# EAGLE design cft-mem-board (EAGLE 7.6.0)

## Sheet 1 of 2
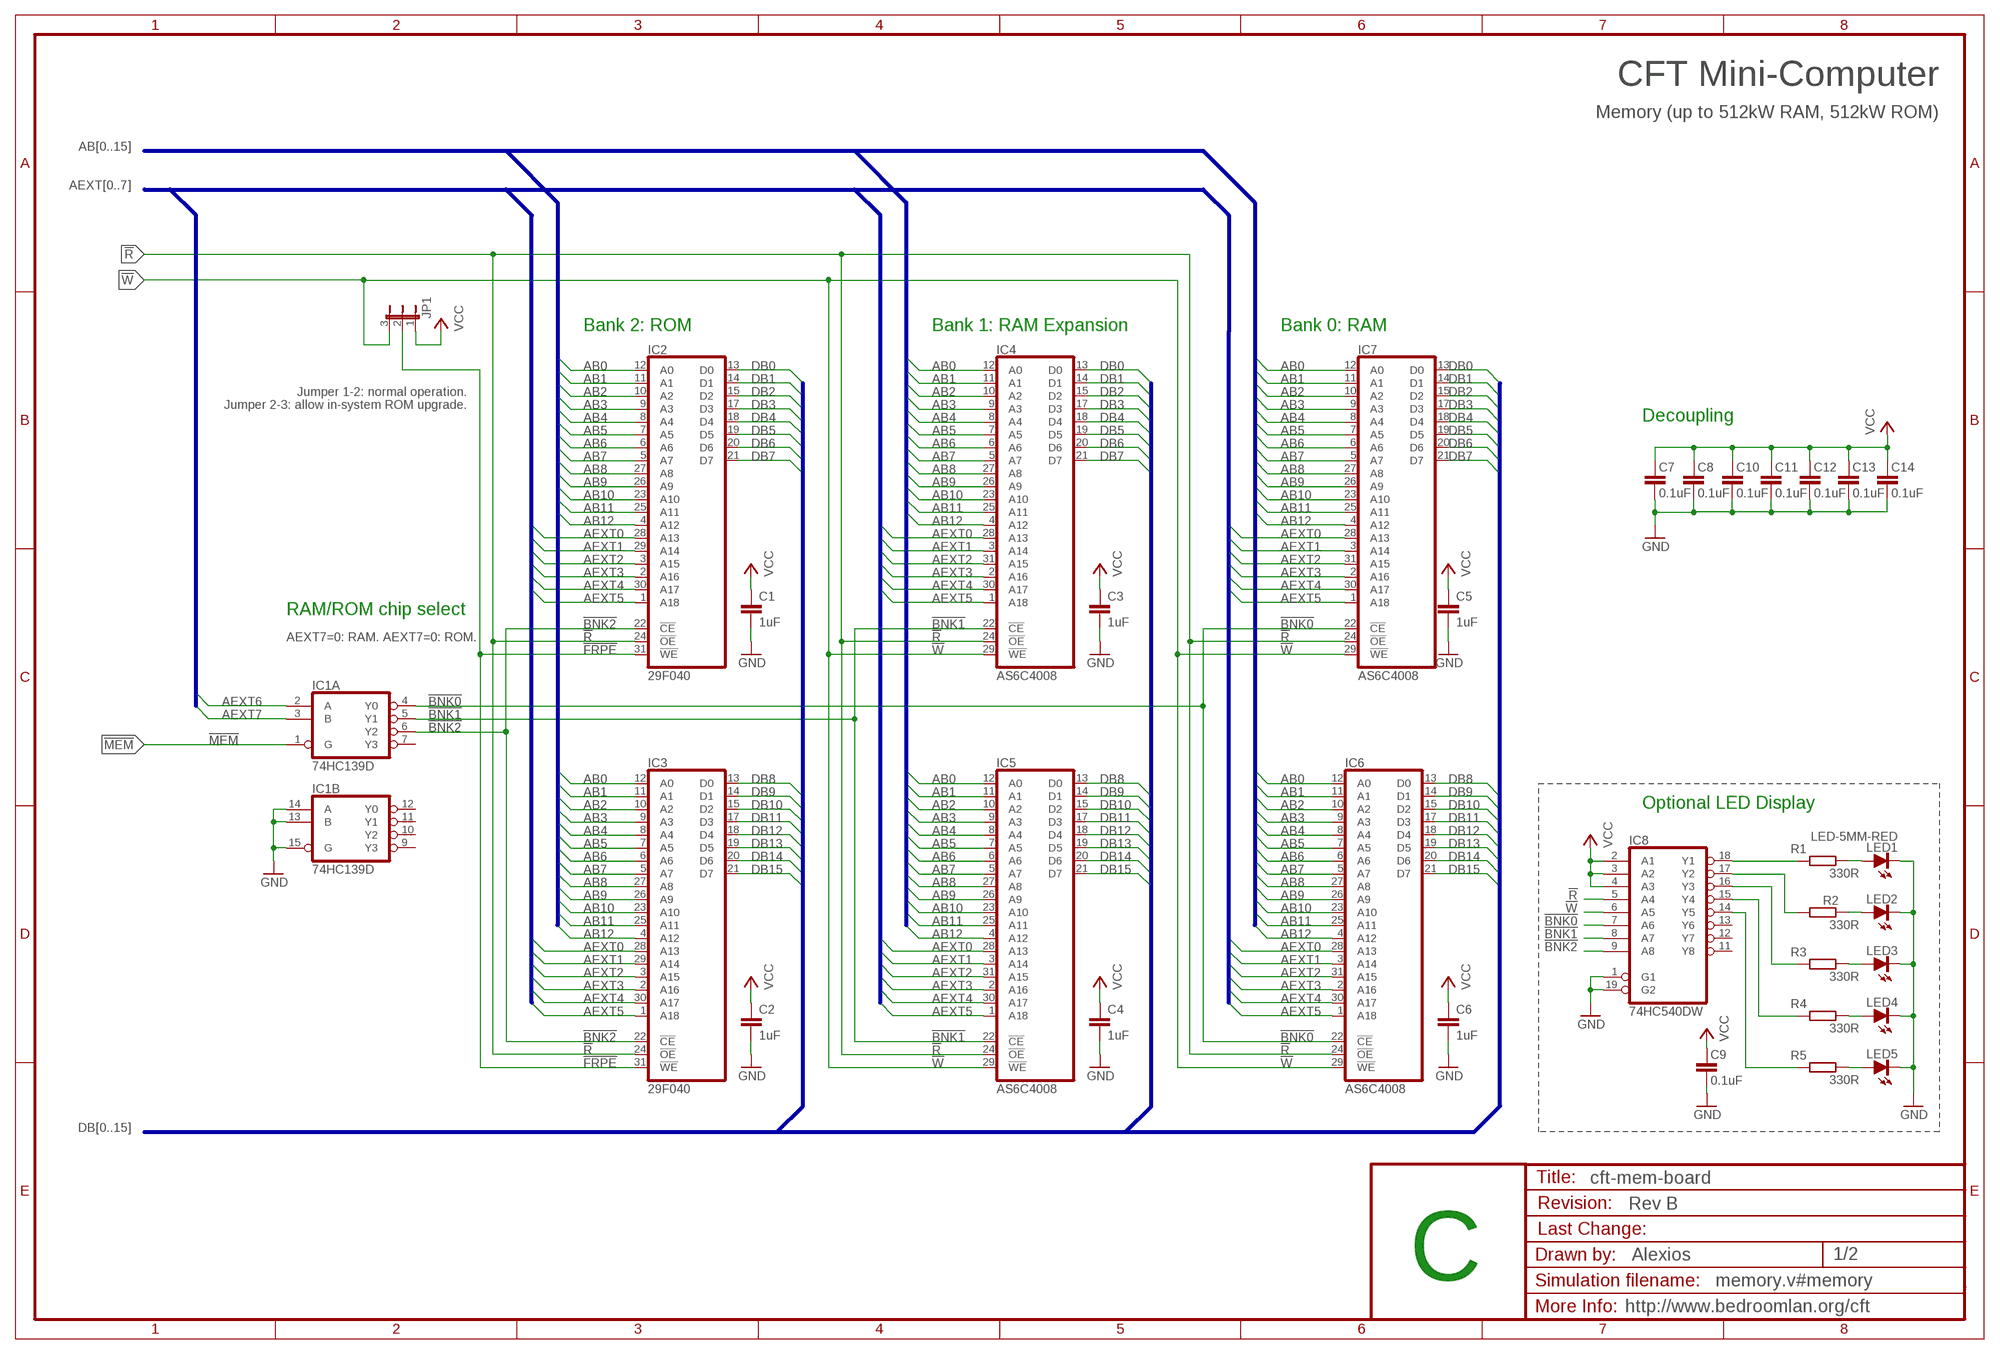
[diagram p0: schematic, sheet 1]
FRAME1 (FRAME-A3): DRAWN_BY: Alexios; PROJECT_NAME: CFT Mini-Computer; REVISION: Rev B; SHEET_DESCRIPTION: Memory (up to 512kW RAM, 512kW ROM); SIMULATION_FILENAME: memory.v#memory; URL: http://www.bedroomlan.org/cft

### Parts
C1  1uF  C-EUC0805K  [C0805K]
C2  1uF  C-EUC0805K  [C0805K]
C3  1uF  C-EUC0805K  [C0805K]
C4  1uF  C-EUC0805K  [C0805K]
C5  1uF  C-EUC0805K  [C0805K]
C6  1uF  C-EUC0805K  [C0805K]
C7  0.1uF  C-EUC0805K  [C0805K]
C8  0.1uF  C-EUC0805K  [C0805K]
C9  0.1uF  C-EUC0805K  [C0805K]
C10  0.1uF  C-EUC0805K  [C0805K]
C11  0.1uF  C-EUC0805K  [C0805K]
C12  0.1uF  C-EUC0805K  [C0805K]
C13  0.1uF  C-EUC0805K  [C0805K]
C14  0.1uF  C-EUC0805K  [C0805K]
IC1  74HC139D  [SO16]
IC2  29F040  29F040PLCC32  [PLCC32]
IC3  29F040  29F040PLCC32  [PLCC32]
IC4  AS6C4008  AS6C400855PCN  [DIL32]
IC5  AS6C4008  AS6C400855PCN  [DIL32]
IC6  AS6C4008  AS6C400855PCN  [DIL32]
IC7  AS6C4008  AS6C400855PCN  [DIL32]
IC8  74HC540DW  [SO20W]
JP1  JP2E  [JP2]
LED1  LED-5MM-RED  LEDCHIPLED_0805  [CHIPLED_0805]
LED2  LEDCHIPLED_0805  [CHIPLED_0805]
LED3  LEDCHIPLED_0805  [CHIPLED_0805]
LED4  LEDCHIPLED_0805  [CHIPLED_0805]
LED5  LEDCHIPLED_0805  [CHIPLED_0805]
R1  330R  R-EU_R0805  [R0805]
R2  330R  R-EU_R0805  [R0805]
R3  330R  R-EU_R0805  [R0805]
R4  330R  R-EU_R0805  [R0805]
R5  330R  R-EU_R0805  [R0805]

### Nets
!BNK0: IC1.4(A:Y0) IC6.22(!CE) IC7.22(!CE) IC8.7(A6)
!BNK1: IC1.5(A:Y1) IC4.22(!CE) IC5.22(!CE) IC8.8(A7)
!BNK2: IC1.6(A:Y2) IC2.22(!CE) IC3.22(!CE) IC8.9(A8)
!FRPE: IC2.31(!WE) IC3.31(!WE) JP1.2
!MEM: IC1.1(A:G) ; also sheet 2
!R: IC2.24(!OE) IC3.24(!OE) IC4.24(!OE) IC5.24(!OE) IC6.24(!OE) IC7.24(!OE) IC8.5(A4) ; also sheet 2
!W: IC4.29(!WE) IC5.29(!WE) IC6.29(!WE) IC7.29(!WE) IC8.6(A5) JP1.3 ; also sheet 2
AB0: IC2.12(A0) IC3.12(A0) IC4.12(A0) IC5.12(A0) IC6.12(A0) IC7.12(A0) ; also sheet 2
AB1: IC2.11(A1) IC3.11(A1) IC4.11(A1) IC5.11(A1) IC6.11(A1) IC7.11(A1) ; also sheet 2
AB2: IC2.10(A2) IC3.10(A2) IC4.10(A2) IC5.10(A2) IC6.10(A2) IC7.10(A2) ; also sheet 2
AB3: IC2.9(A3) IC3.9(A3) IC4.9(A3) IC5.9(A3) IC6.9(A3) IC7.9(A3) ; also sheet 2
AB4: IC2.8(A4) IC3.8(A4) IC4.8(A4) IC5.8(A4) IC6.8(A4) IC7.8(A4) ; also sheet 2
AB5: IC2.7(A5) IC3.7(A5) IC4.7(A5) IC5.7(A5) IC6.7(A5) IC7.7(A5) ; also sheet 2
AB6: IC2.6(A6) IC3.6(A6) IC4.6(A6) IC5.6(A6) IC6.6(A6) IC7.6(A6) ; also sheet 2
AB7: IC2.5(A7) IC3.5(A7) IC4.5(A7) IC5.5(A7) IC6.5(A7) IC7.5(A7) ; also sheet 2
AB8: IC2.27(A8) IC3.27(A8) IC4.27(A8) IC5.27(A8) IC6.27(A8) IC7.27(A8) ; also sheet 2
AB9: IC2.26(A9) IC3.26(A9) IC4.26(A9) IC5.26(A9) IC6.26(A9) IC7.26(A9) ; also sheet 2
AB10: IC2.23(A10) IC3.23(A10) IC4.23(A10) IC5.23(A10) IC6.23(A10) IC7.23(A10) ; also sheet 2
AB11: IC2.25(A11) IC3.25(A11) IC4.25(A11) IC5.25(A11) IC6.25(A11) IC7.25(A11) ; also sheet 2
AB12: IC2.4(A12) IC3.4(A12) IC4.4(A12) IC5.4(A12) IC6.4(A12) IC7.4(A12) ; also sheet 2
AEXT0: IC2.28(A13) IC3.28(A13) IC4.28(A13) IC5.28(A13) IC6.28(A13) IC7.28(A13) ; also sheet 2
AEXT1: IC2.29(A14) IC3.29(A14) IC4.3(A14) IC5.3(A14) IC6.3(A14) IC7.3(A14) ; also sheet 2
AEXT2: IC2.3(A15) IC3.3(A15) IC4.31(A15) IC5.31(A15) IC6.31(A15) IC7.31(A15) ; also sheet 2
AEXT3: IC2.2(A16) IC3.2(A16) IC4.2(A16) IC5.2(A16) IC6.2(A16) IC7.2(A16) ; also sheet 2
AEXT4: IC2.30(A17) IC3.30(A17) IC4.30(A17) IC5.30(A17) IC6.30(A17) IC7.30(A17) ; also sheet 2
AEXT5: IC2.1(A18) IC3.1(A18) IC4.1(A18) IC5.1(A18) IC6.1(A18) IC7.1(A18) ; also sheet 2
AEXT6: IC1.2(A:A) ; also sheet 2
AEXT7: IC1.3(A:B) ; also sheet 2
DB0: IC2.13(D0) IC4.13(D0) IC7.13(D0) ; also sheet 2
DB1: IC2.14(D1) IC4.14(D1) IC7.14(D1) ; also sheet 2
DB2: IC2.15(D2) IC4.15(D2) IC7.15(D2) ; also sheet 2
DB3: IC2.17(D3) IC4.17(D3) IC7.17(D3) ; also sheet 2
DB4: IC2.18(D4) IC4.18(D4) IC7.18(D4) ; also sheet 2
DB5: IC2.19(D5) IC4.19(D5) IC7.19(D5) ; also sheet 2
DB6: IC2.20(D6) IC4.20(D6) IC7.20(D6) ; also sheet 2
DB7: IC2.21(D7) IC4.21(D7) IC7.21(D7) ; also sheet 2
DB8: IC3.13(D0) IC5.13(D0) IC6.13(D0) ; also sheet 2
DB9: IC3.14(D1) IC5.14(D1) IC6.14(D1) ; also sheet 2
DB10: IC3.15(D2) IC5.15(D2) IC6.15(D2) ; also sheet 2
DB11: IC3.17(D3) IC5.17(D3) IC6.17(D3) ; also sheet 2
DB12: IC3.18(D4) IC5.18(D4) IC6.18(D4) ; also sheet 2
DB13: IC3.19(D5) IC5.19(D5) IC6.19(D5) ; also sheet 2
DB14: IC3.20(D6) IC5.20(D6) IC6.20(D6) ; also sheet 2
DB15: IC3.21(D7) IC5.21(D7) IC6.21(D7) ; also sheet 2
GND [low power]: C1.2 C2.2 C3.2 C4.2 C5.2 C6.2 C7.1 C8.1 C9.1 C10.1 C11.1 C12.1 C13.1 C14.1 IC1.13(B:B) IC1.14(B:A) IC1.15(B:G) IC8.1(G1) IC8.19(G2) LED1.C LED2.C LED3.C LED4.C LED5.C ; also sheet 2
N$1: LED1.A R1.2
N$2: LED2.A R2.2
N$3: LED3.A R3.2
N$4: LED4.A R4.2
N$5: LED5.A R5.2
N$6: IC8.14(Y5) R5.1
N$7: IC8.17(Y2) R2.1
N$8: IC8.16(Y3) R3.1
N$9: IC8.15(Y4) R4.1
N$10: IC8.18(Y1) R1.1
VCC [low power]: C1.1 C2.1 C3.1 C4.1 C5.1 C6.1 C7.2 C8.2 C9.2 C10.2 C11.2 C12.2 C13.2 C14.2 IC8.2(A1) IC8.3(A2) IC8.4(A3) JP1.1 ; also sheet 2
Unconnected: IC1.7(A:Y3) IC1.9(B:Y3) IC1.10(B:Y2) IC1.11(B:Y1) IC1.12(B:Y0) IC8.11(Y8) IC8.12(Y7) IC8.13(Y6)

### Buses
AB[0..15]
DB[0..15]
AEXT[0..7]

### Notes on the sheet
- Bank 2: ROM | Bank 1: RAM Expansion | Bank 0: RAM
- Jumper 1-2: normal operation.
- Jumper 2-3: allow in-system ROM upgrade.
- Decoupling
- RAM/ROM chip select
- AEXT7=0: RAM. AEXT7=0: ROM.
- Optional LED Display
- C

## Sheet 2 of 2
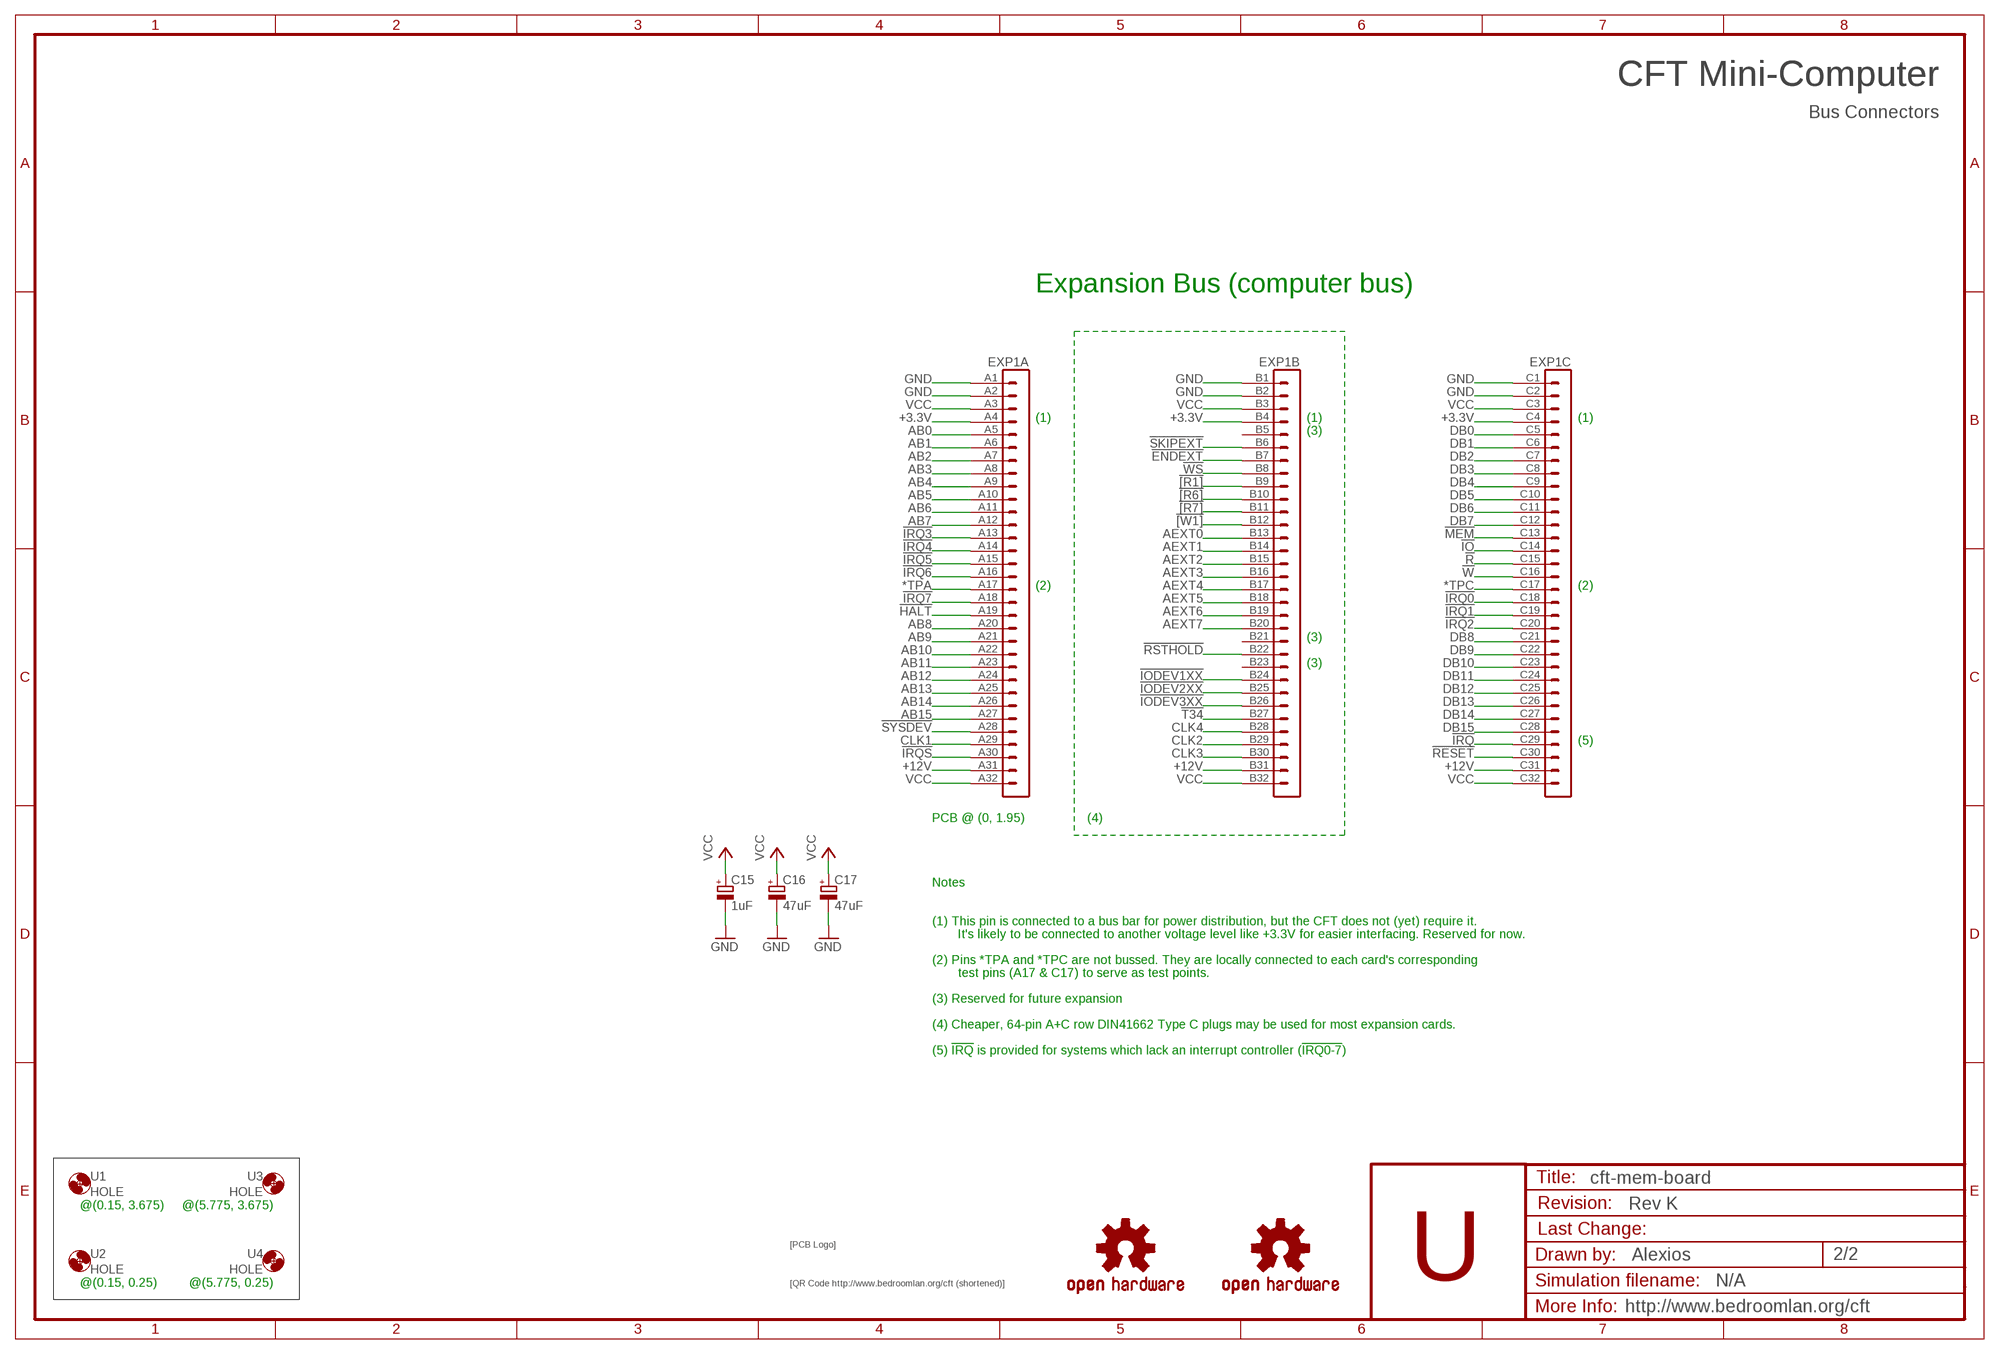
[diagram p1: schematic, sheet 2]
FRAME2 (FRAME-A3): DRAWN_BY: Alexios; PROJECT_NAME: CFT Mini-Computer; REVISION: Rev K; SHEET_DESCRIPTION: Bus Connectors; SIMULATION_FILENAME: N/A; URL: http://www.bedroomlan.org/cft

### Parts
$4_37_$1  SIGNATURESILK  [SIGNATURE]
$4_39_$  OSHW-LOGOL  [OSHW-LOGO-L]
$4_39_$1  OSHW-LOGOL  [OSHW-LOGO-L]
$4_40_$  QRCODE-CFT  [CFT-QRCODE]
C15  1uF  CPOL-EUE2.5-5  [E2,5-5]
C16  47uF  CPOL-EUE2.5-5  [E2,5-5]
C17  47uF  CPOL-EUE2.5-5  [E2,5-5]
EXP1  VG96-3K  [VG96K]
U1  HOLE  [STANDOFF_28_60]
U2  HOLE  [STANDOFF_28_60]
U3  HOLE  [STANDOFF_28_60]
U4  HOLE  [STANDOFF_28_60]

### Nets
![R1]: EXP1.B9
![R6]: EXP1.B10
![R7]: EXP1.B11
![W1]: EXP1.B12
!ENDEXT: EXP1.B7
!HALT: EXP1.A19
!IO: EXP1.C14
!IODEV1XX: EXP1.B24
!IODEV2XX: EXP1.B25
!IODEV3XX: EXP1.B26
!IRQ: EXP1.C29
!IRQ0: EXP1.C18
!IRQ1: EXP1.C19
!IRQ2: EXP1.C20
!IRQ3: EXP1.A13
!IRQ4: EXP1.A14
!IRQ5: EXP1.A15
!IRQ6: EXP1.A16
!IRQ7: EXP1.A18
!IRQS: EXP1.A30
!MEM: EXP1.C13 ; also sheet 1
!R: EXP1.C15 ; also sheet 1
!RESET: EXP1.C30
!RSTHOLD: EXP1.B22
!SKIPEXT: EXP1.B6
!SYSDEV: EXP1.A28
!T34: EXP1.B27
!W: EXP1.C16 ; also sheet 1
!WS: EXP1.B8
*TPA: EXP1.A17
*TPC: EXP1.C17
+3.3V: EXP1.A4 EXP1.B4 EXP1.C4
+12V [Power rails]: EXP1.A31 EXP1.B31 EXP1.C31
AB0: EXP1.A5 ; also sheet 1
AB1: EXP1.A6 ; also sheet 1
AB2: EXP1.A7 ; also sheet 1
AB3: EXP1.A8 ; also sheet 1
AB4: EXP1.A9 ; also sheet 1
AB5: EXP1.A10 ; also sheet 1
AB6: EXP1.A11 ; also sheet 1
AB7: EXP1.A12 ; also sheet 1
AB8: EXP1.A20 ; also sheet 1
AB9: EXP1.A21 ; also sheet 1
AB10: EXP1.A22 ; also sheet 1
AB11: EXP1.A23 ; also sheet 1
AB12: EXP1.A24 ; also sheet 1
AB13: EXP1.A25
AB14: EXP1.A26
AB15: EXP1.A27
AEXT0: EXP1.B13 ; also sheet 1
AEXT1: EXP1.B14 ; also sheet 1
AEXT2: EXP1.B15 ; also sheet 1
AEXT3: EXP1.B16 ; also sheet 1
AEXT4: EXP1.B17 ; also sheet 1
AEXT5: EXP1.B18 ; also sheet 1
AEXT6: EXP1.B19 ; also sheet 1
AEXT7: EXP1.B20 ; also sheet 1
CLK1: EXP1.A29
CLK2: EXP1.B29
CLK3: EXP1.B30
CLK4: EXP1.B28
DB0: EXP1.C5 ; also sheet 1
DB1: EXP1.C6 ; also sheet 1
DB2: EXP1.C7 ; also sheet 1
DB3: EXP1.C8 ; also sheet 1
DB4: EXP1.C9 ; also sheet 1
DB5: EXP1.C10 ; also sheet 1
DB6: EXP1.C11 ; also sheet 1
DB7: EXP1.C12 ; also sheet 1
DB8: EXP1.C21 ; also sheet 1
DB9: EXP1.C22 ; also sheet 1
DB10: EXP1.C23 ; also sheet 1
DB11: EXP1.C24 ; also sheet 1
DB12: EXP1.C25 ; also sheet 1
DB13: EXP1.C26 ; also sheet 1
DB14: EXP1.C27 ; also sheet 1
DB15: EXP1.C28 ; also sheet 1
GND [low power]: C15.- C16.- C17.- EXP1.A1 EXP1.A2 EXP1.B1 EXP1.B2 EXP1.C1 EXP1.C2 ; also sheet 1
VCC [low power]: C15.+ C16.+ C17.+ EXP1.A3 EXP1.A32 EXP1.B3 EXP1.B32 EXP1.C3 EXP1.C32 ; also sheet 1
Unconnected: EXP1.B5 EXP1.B21 EXP1.B23

### Notes on the sheet
- CFT Mini-Computer
- Expansion Bus (computer bus)
- (1) | (1) | (1)
- (3)
- (2) | (2)
- (3)
- (3)
- (5)
- PCB @ (0, 1.95) | (4)
- Notes
- (1) This pin is connected to a bus bar for power distribution, but the CFT does not (yet) require it.
- It's likely to be connected to another voltage level like +3.3V for easier interfacing. Reserved for now.
- (2) Pins *TPA and *TPC are not bussed. They are locally connected to each card's corresponding
- test pins (A17 & C17) to serve as test points.
- (3) Reserved for future expansion
- (4) Cheaper, 64-pin A+C row DIN41662 Type C plugs may be used for most expansion cards.
- (5) !IRQ! is provided for systems which lack an interrupt controller (!IRQ0-7!)
- @(0.15, 3.675) | @(5.775, 3.675)
- U
- @(0.15, 0.25) | @(5.775, 0.25)

## Power pins joined to a net without a drawn wire
GND: IC1.8(P:GND) IC2.16(GND) IC3.16(GND) IC4.16(GND) IC5.16(GND) IC6.16(GND) IC7.16(GND) IC8.10(GND)
VCC: IC1.16(P:VCC) IC2.32(VCC) IC3.32(VCC) IC4.32(VCC) IC5.32(VCC) IC6.32(VCC) IC7.32(VCC) IC8.20(VCC)

## Library data of the parts
$4_37_$1 = alexios:SIGNATURE: Soup signature
$4_39_$ $4_39_$1 = SparkFun:OSHW-LOGO: Open Source Hardware Logo This logo indicates the piece of hardware it is found on incorporates a OSHW license and/or adheres to the definition of open source hardware found here: http://freedomdefined.org/OSHW
$4_40_$ = alexios:QRCODE-*: Various QR codes in silkscreen.
C1-C14 = rcl:C-EU: CAPACITOR, European symbol
C15-C17 = rcl:CPOL-EU: POLARIZED CAPACITOR, European symbol
EXP1 = alexios-19inch:VG96-3: PCB EUROCARD, 96-pin type C/ABC, 2.54 mm
IC1 = alexios:74*139: Dual 2-line to 4-line DECODER/DEMULTIPLEXER
IC2 IC3 = alexios:29F040: 4-mbit (512x8) Flash memory in a PLCC32 package (with socket). AM29F040 is an example of this.
IC4-IC7 = alexios:AS6C4008: 512k×8 Bit Low Power CMOS RAM Notes: Access time: 55 ns Low power consumption. Operating current: 30/20mA (TYP.) Standby current: 4 µA (TYP.) C-version Single 2.7V­­-5.5V power supply Fully static operation Tri-state output Data retention voltage: 2.0V (MIN.) Datasheet: http://www.farnell.com/datasheets/39223.pdf Farnell code: 1562900
IC8 = alexios:74*540: Octal BUFFER and LINE DRIVER, 3-state
JP1 = jumper:JP2E: JUMPER
LED1-LED5 = alexios:LED: LED OSRAM: - CHIPLED LG R971, LG N971, LY N971, LG Q971, LY Q971, LO R971, LY R971 LH N974, LH R974 LS Q976, LO Q976, LY Q976 LO Q996 - Hyper CHIPLED LW Q18S LB Q993, LB Q99A, LB R99A - SideLED LS A670, LO A670, LY A670, LG A670, LP A670 LB A673, LV A673, LT A673, LW A673 LH A674 LY A675 LS A676, LA A676, LO A676, LY A676, LW A676 LS A679, LY A679, LG A679 - Hyper Micro SIDELED® LS Y876, LA Y876, LO Y876, LY Y876 LT Y87S - SmartLED LW L88C, LW L88S LB L89C, LB L89S, LG L890 LS L89K, LO L89K, LY L89K LS L896, LA L896, LO L896, LY L896 - TOPLED LS T670, LO T670, LY T670, LG T670, LP T670 LSG T670, LSP T670, LSY T670, LOP T670, LYG T670 LG T671, LOG T671, LSG T671 LB T673, LV T673, LT T673, LW T673 LH T674 LS T676, LA T676, LO T676, LY T676, LB T676, LH T676, LSB T676, LW T676 LB T67C, LV T67C, LT T67C, LS T67K, LO T67K, LY T67K, LW E67C LS E67B, LA E67B, LO E67B, LY E67B, LB E67C, LV E67C, LT E67C LW T67C LS T679, LY T679, LG T679 LS T770, LO T770, LY T770, LG T770, LP T770 LB T773, LV T773, LT T773, LW T773 LH T774 LS E675, LA E675, LY E675, LS T675 LS T776, LA T776, LO T776, LY T776, LB T776 LHGB T686 LT T68C, LB T68C - Hyper Mini TOPLED® LB M676 - Mini TOPLED Santana® LG M470 LS M47K, LO M47K, LY M47K Source: http://www.osram.convergy.de LUXEON: - LUMILED® LXK2-PW12-R00, LXK2-PW12-S00, LXK2-PW14-U00, LXK2-PW14-V00 LXK2-PM12-R00, LXK2-PM12-S00, LXK2-PM14-U00 LXK2-PE12-Q00, LXK2-PE12-R00, LXK2-PE12-S00, LXK2-PE14-T00, LXK2-PE14-U00 LXK2-PB12-K00, LXK2-PB12-L00, LXK2-PB12-M00, LXK2-PB14-N00, LXK2-PB14-P00, LXK2-PB14-Q00 LXK2-PR12-L00, LXK2-PR12-M00, LXK2-PR14-Q00, LXK2-PR14-R00 LXK2-PD12-Q00, LXK2-PD12-R00, LXK2-PD12-S00 LXK2-PH12-R00, LXK2-PH12-S00 LXK2-PL12-P00, LXK2-PL12-Q00, LXK2-PL12-R00 Source: www.luxeon.com KINGBRIGHT: KA-3528ASYC Source: www.kingbright.com
R1-R5 = rcl:R-EU_: RESISTOR, European symbol
U1-U4 = alexios:HOLE: Hole for a standoff or mount. Hole diameter: 3.3mm. External Diameter: 6mm. Suitable for M3 standoffs.

## Net classes
0 default: width 0.254 mm, clearance 0.152 mm
1 low power: width 1.27 mm, clearance 0.254 mm
2 Power rails: width 0.61 mm, clearance 0.152 mm

## Board
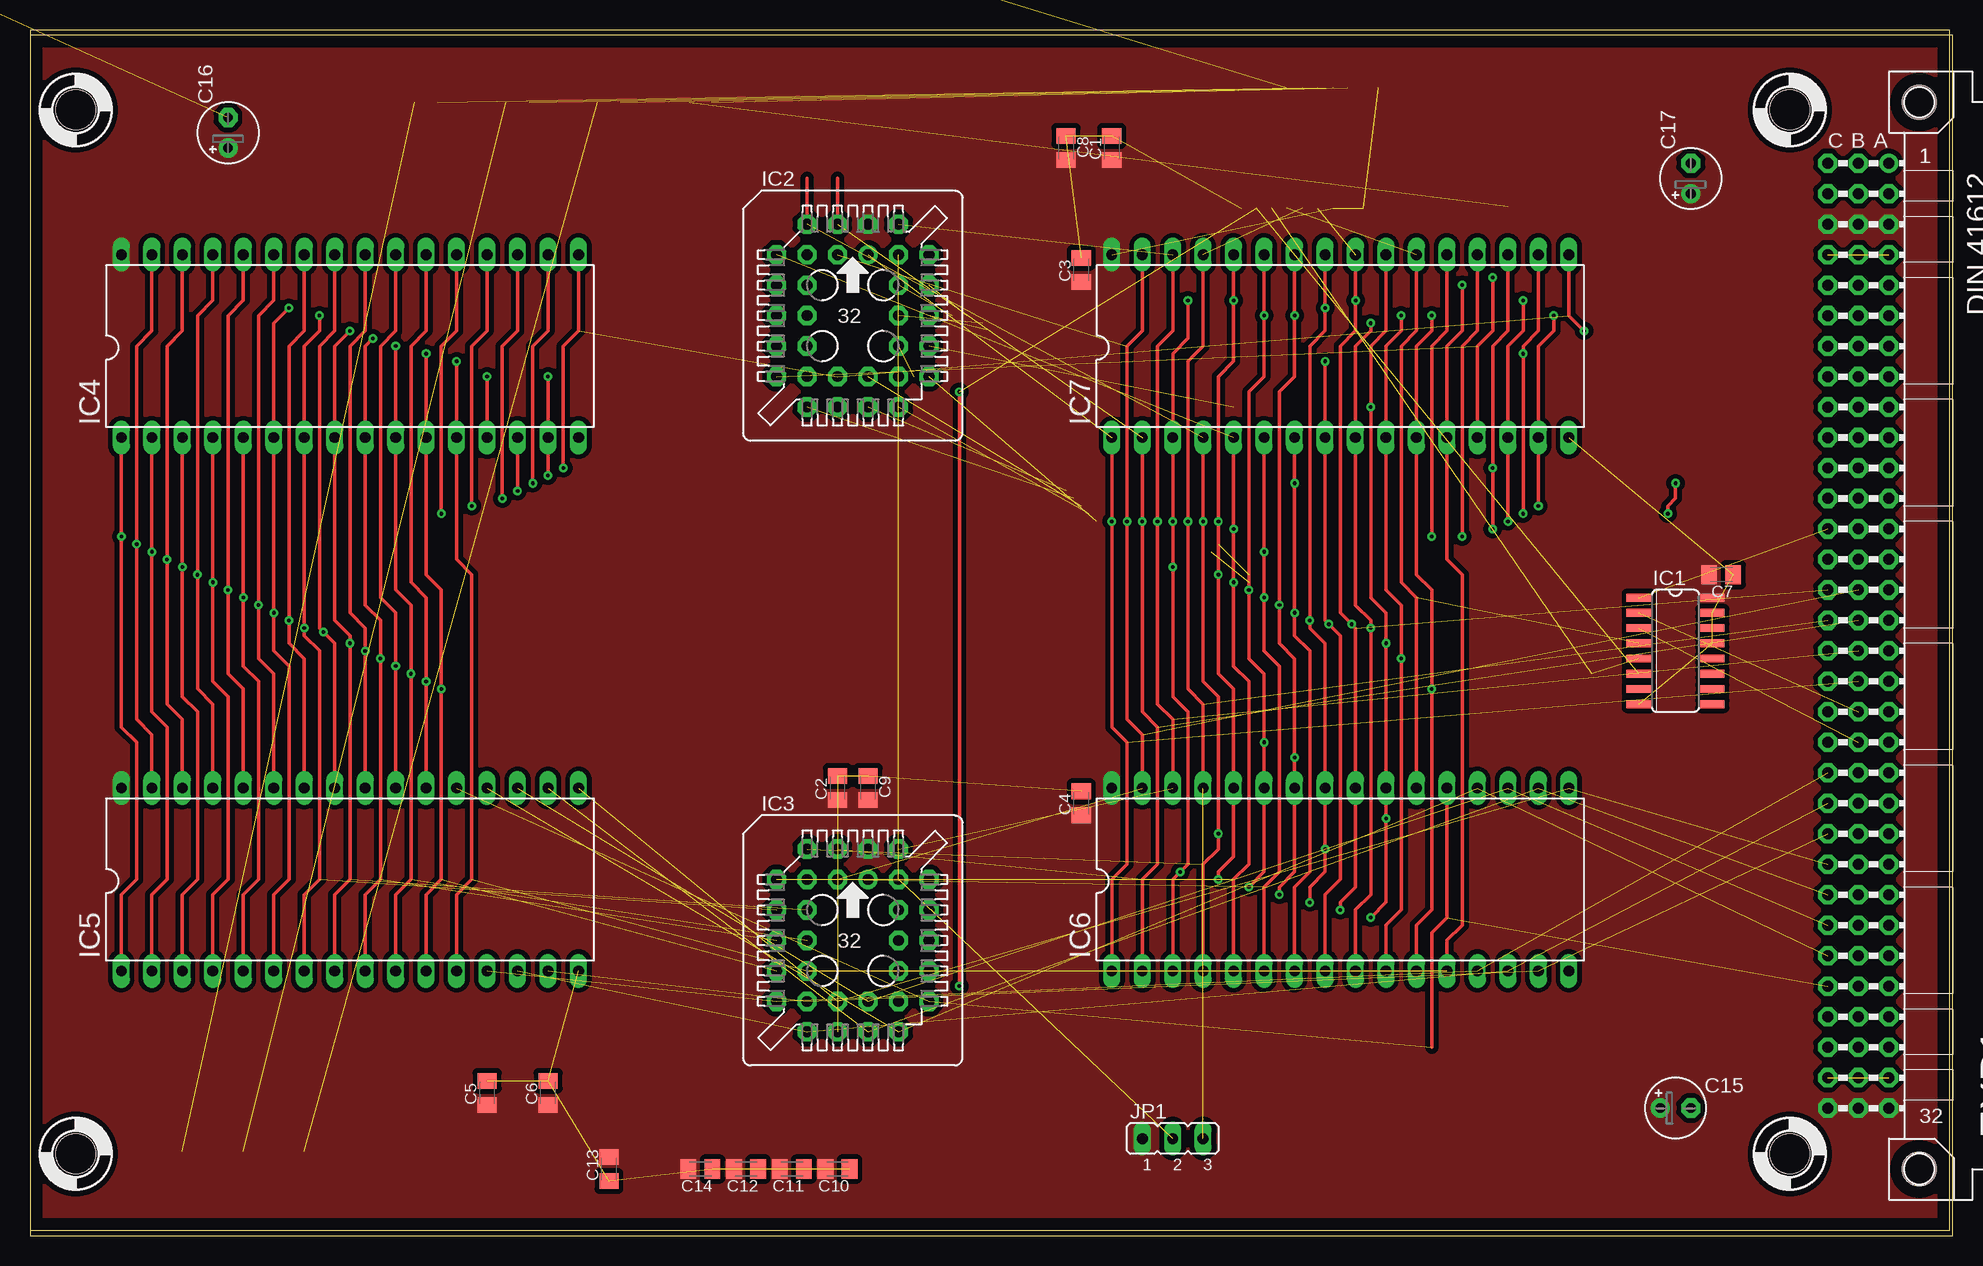
[diagram p2: board, top side]
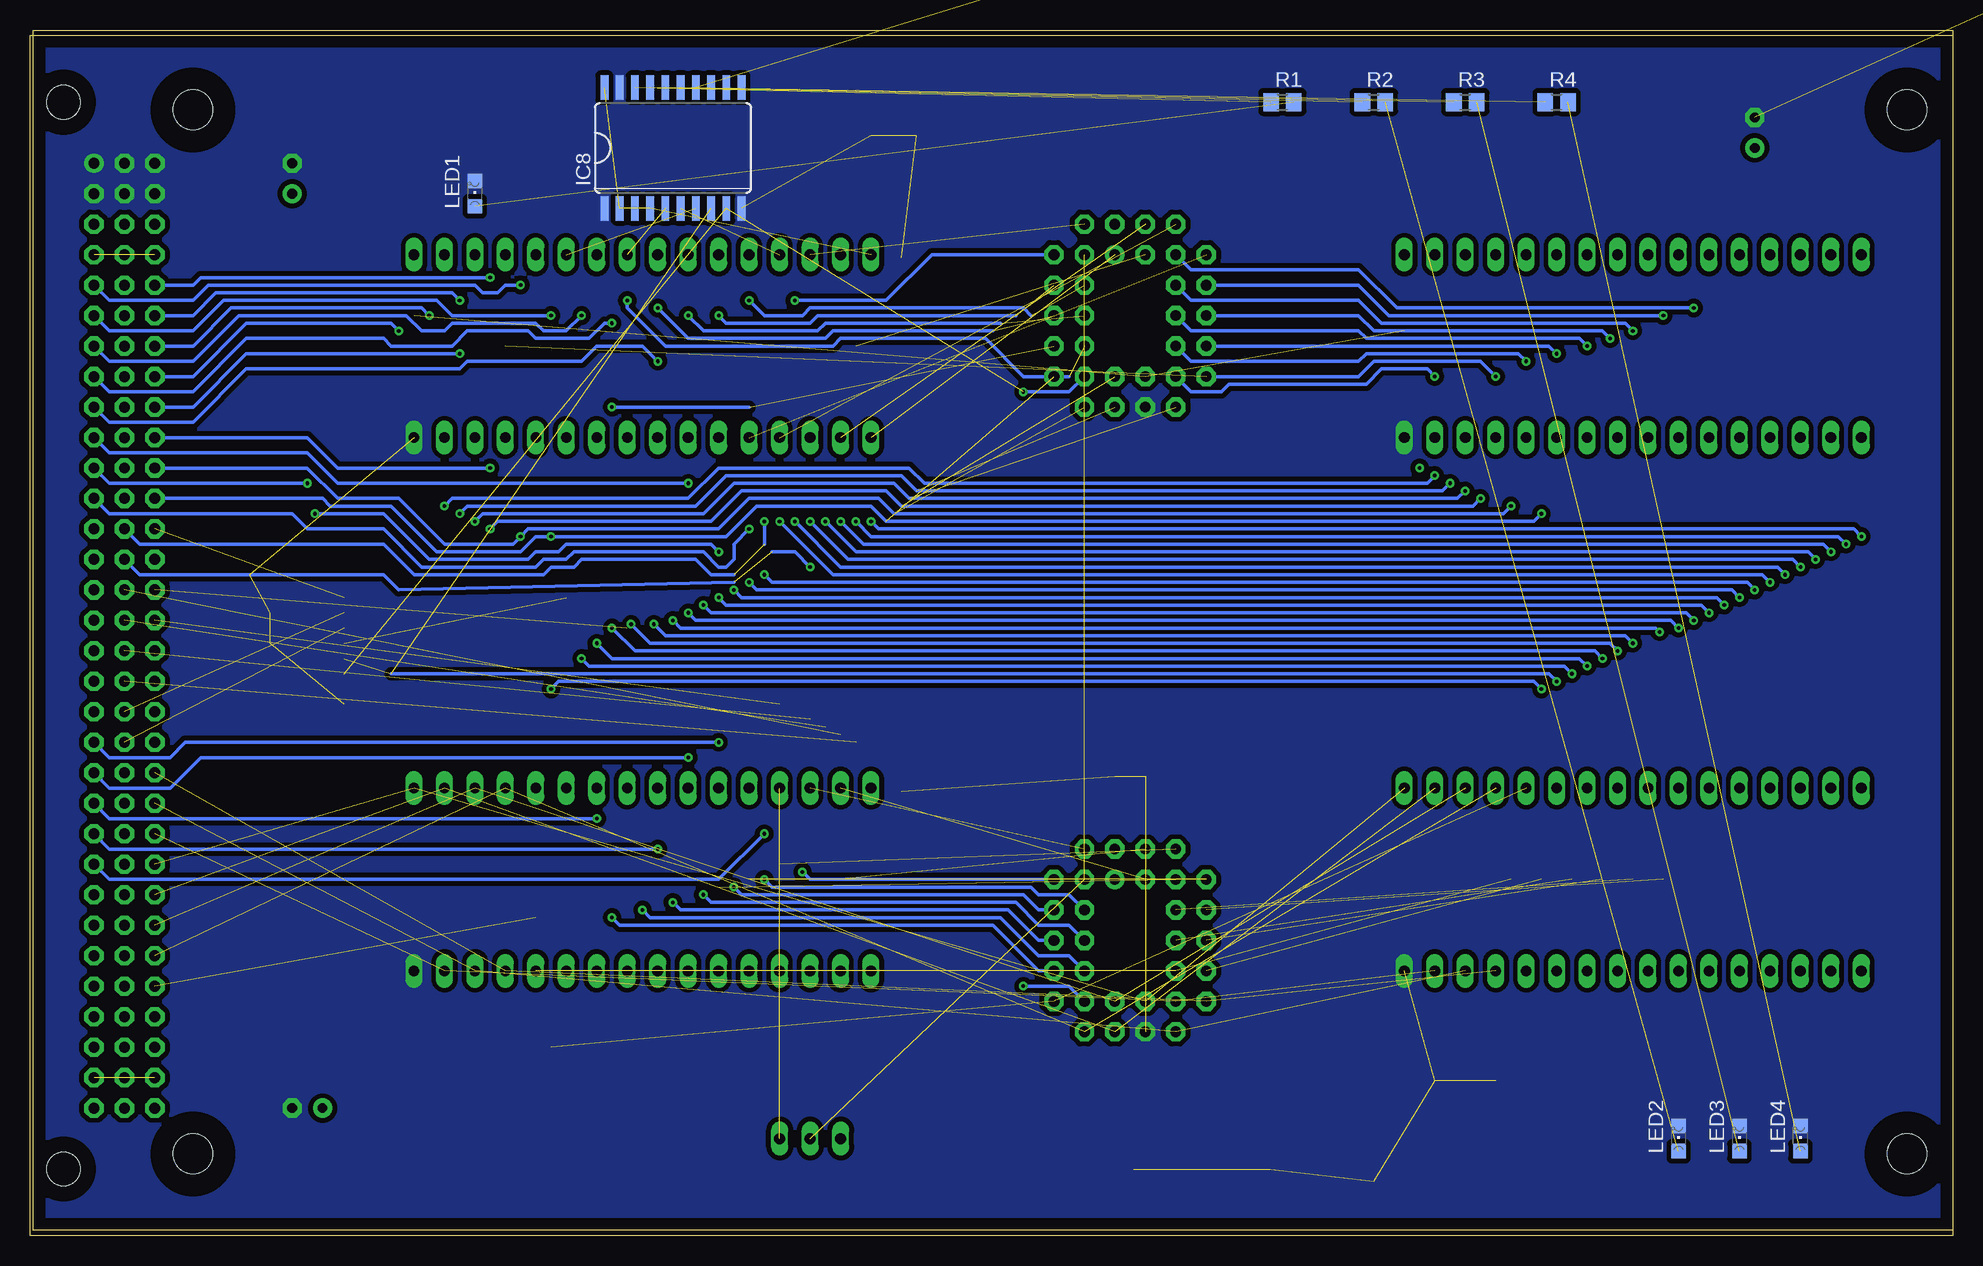
[diagram p3: board, bottom side, seen from below]

Size 160 x 100 mm. Coordinates in mm from the lower left corner, seen from the top.
Outline: 0,0 160,0 160,100 0,100 0,0
Copper layers (1*16): Top 0.035mm / dielectric 1.5mm / Bottom 0.035mm
Design rules "default": minimum track width 10mil, minimum drill 24mil, track to track 8mil, track to pad 8mil, pad to pad 8mil, via to via 8mil, smd to smd 8mil, copper to edge 40mil, drill to drill 8mil, minimum pad ring 10mil, minimum via ring 8mil, stop-mask expansion 4mil, vias tented up to drill 0mil, thermal gap 10mil

### Footprints (pad centres in the part's own frame; a part is rotated, then mirrored left to right if it is on the bottom)
C0805K = smd 1.3 x 1.6: 1 -1,0; 2 1,0
E2,5-5 = drill 0.813 pad 1.6 round: + -1.27,0 | drill 0.813 pad 1.6 octagon: - 1.27,0
VG96K = drill 0.914 pad 1.6 round: A1 154.94,39.37 | drill 0.914 pad 1.6 octagon: A2 154.94,36.83; A3 154.94,34.29; A4 154.94,31.75; A5 154.94,29.21; A6 154.94,26.67; A7 154.94,24.13; A8 154.94,21.59; A9 154.94,19.05; A10 154.94,16.51; A11 154.94,13.97; A12 154.94,11.43; A13 154.94,8.89; A14 154.94,6.35; A15 154.94,3.81; A16 154.94,1.27; A17 154.94,-1.27; A18 154.94,-3.81; A19 154.94,-6.35; A20 154.94,-8.89; A21 154.94,-11.43; A22 154.94,-13.97; A23 154.94,-16.51; A24 154.94,-19.05; A25 154.94,-21.59; A26 154.94,-24.13; A27 154.94,-26.67; A28 154.94,-29.21; A29 154.94,-31.75; A30 154.94,-34.29; A31 154.94,-36.83; A32 154.94,-39.37; B1 152.4,39.37; B2 152.4,36.83; B3 152.4,34.29; B4 152.4,31.75; B5 152.4,29.21; B6 152.4,26.67; B7 152.4,24.13; B8 152.4,21.59; B9 152.4,19.05; B10 152.4,16.51; B11 152.4,13.97; B12 152.4,11.43; B13 152.4,8.89; B14 152.4,6.35; B15 152.4,3.81; B16 152.4,1.27; B17 152.4,-1.27; B18 152.4,-3.81; B19 152.4,-6.35; B20 152.4,-8.89; B21 152.4,-11.43; B22 152.4,-13.97; B23 152.4,-16.51; B24 152.4,-19.05; B25 152.4,-21.59; B26 152.4,-24.13; B27 152.4,-26.67; B28 152.4,-29.21; B29 152.4,-31.75; B30 152.4,-34.29; B31 152.4,-36.83; B32 152.4,-39.37; C1 149.86,39.37; C2 149.86,36.83; C3 149.86,34.29; C4 149.86,31.75; C5 149.86,29.21; C6 149.86,26.67; C7 149.86,24.13; C8 149.86,21.59; C9 149.86,19.05; C10 149.86,16.51; C11 149.86,13.97; C12 149.86,11.43; C13 149.86,8.89; C14 149.86,6.35; C15 149.86,3.81; C16 149.86,1.27; C17 149.86,-1.27; C18 149.86,-3.81; C19 149.86,-6.35; C20 149.86,-8.89; C21 149.86,-11.43; C22 149.86,-13.97; C23 149.86,-16.51; C24 149.86,-19.05; C25 149.86,-21.59; C26 149.86,-24.13; C27 149.86,-26.67; C28 149.86,-29.21; C29 149.86,-31.75; C30 149.86,-34.29; C31 149.86,-36.83; C32 149.86,-39.37 | hole 2.794: 157.48,44.45; 157.48,-44.45
SO16 = smd 0.66 x 2.032: 1 -4.445,-3.073; 2 -3.175,-3.073; 3 -1.905,-3.073; 4 -0.635,-3.073; 5 0.635,-3.073; 6 1.905,-3.073; 7 3.175,-3.073; 8 4.445,-3.073; 9 4.445,3.073; 10 3.175,3.073; 11 1.905,3.073; 12 0.635,3.073; 13 -0.635,3.073; 14 -1.905,3.073; 15 -3.175,3.073; 16 -4.445,3.073
PLCC32 = drill 0.9 pad 1.6 round: 1 1.27,5.08 | drill 0.9 pad 1.6 octagon: 2 -1.27,7.62; 3 -1.27,5.08; 4 -3.81,7.62; 5 -6.35,5.08; 6 -3.81,5.08; 7 -6.35,2.54; 8 -3.81,2.54; 9 -6.35,0; 10 -3.81,0; 11 -6.35,-2.54; 12 -3.81,-2.54; 13 -6.35,-5.08; 14 -3.81,-7.62; 15 -3.81,-5.08; 16 -1.27,-7.62; 17 -1.27,-5.08; 18 1.27,-7.62; 19 1.27,-5.08; 20 3.81,-7.62; 21 6.35,-5.08; 22 3.81,-5.08; 23 6.35,-2.54; 24 3.81,-2.54; 25 6.35,0; 26 3.81,0; 27 6.35,2.54; 28 3.81,2.54; 29 6.35,5.08; 30 3.81,7.62; 31 3.81,5.08; 32 1.27,7.62
DIL32 = drill 0.9 long: 1 -19.05,-7.62; 2 -16.51,-7.62; 3 -13.97,-7.62; 4 -11.43,-7.62; 5 -8.89,-7.62; 6 -6.35,-7.62; 7 -3.81,-7.62; 8 -1.27,-7.62; 9 1.27,-7.62; 10 3.81,-7.62; 11 6.35,-7.62; 12 8.89,-7.62; 13 11.43,-7.62; 14 13.97,-7.62; 15 16.51,-7.62; 16 19.05,-7.62; 17 19.05,7.62; 18 16.51,7.62; 19 13.97,7.62; 20 11.43,7.62; 21 8.89,7.62; 22 6.35,7.62; 23 3.81,7.62; 24 1.27,7.62; 25 -1.27,7.62; 26 -3.81,7.62; 27 -6.35,7.62; 28 -8.89,7.62; 29 -11.43,7.62; 30 -13.97,7.62; 31 -16.51,7.62; 32 -19.05,7.62
SO20W = smd 0.66 x 2.032: 1 -5.715,-5.029; 2 -4.445,-5.029; 3 -3.175,-5.029; 4 -1.905,-5.029; 5 -0.635,-5.029; 6 0.635,-5.029; 7 1.905,-5.029; 8 3.175,-5.029; 9 4.445,-5.029; 10 5.715,-5.029; 11 5.715,5.029; 12 4.445,5.029; 13 3.175,5.029; 14 1.905,5.029; 15 0.635,5.029; 16 -0.635,5.029; 17 -1.905,5.029; 18 -3.175,5.029; 19 -4.445,5.029; 20 -5.715,5.029
JP2 = drill 0.914 long: 1 -2.54,0; 2 0,0; 3 2.54,0
CHIPLED_0805 = smd 1.2 x 1.2: A 0,-1.05; C 0,1.05
R0805 = smd 1.3 x 1.5: 1 -0.95,0; 2 0.95,0
STANDOFF_28_60 = hole 3.302: 0,0

### Placement (x,y rotation side)
$4_37_$1  -43.18,-16.51 0 top  (outside the outline)
$4_39_$  -29.21,-11.43 0 top  (outside the outline)
$4_39_$1  -20.32,-11.43 0 top  (outside the outline)
$4_40_$  -22.86,6.35 0 top  (outside the outline)
C1  90.17,90.17 90 top
C2  67.31,36.83 90 top
C3  87.63,80.01 90 top
C4  87.63,35.56 90 top
C5  38.1,11.43 90 top
C6  43.18,11.43 90 top
C7  140.97,54.61 180 top
C8  86.36,90.17 270 top
C9  69.85,36.83 270 top
C10  67.31,5.08 180 top
C11  63.5,5.08 180 top
C12  59.69,5.08 180 top
C13  48.26,5.08 90 top
C14  55.88,5.08 180 top
C15  137.16,10.16 0 top
C16  16.51,91.44 90 top
C17  138.43,87.63 90 top
EXP1  0,49.53 0 top
IC1  137.16,48.26 270 top
IC2  68.58,76.2 0 top
IC3  68.58,24.13 0 top
IC4  26.67,73.66 0 top
IC5  26.67,29.21 0 top
IC6  109.22,29.21 0 top
IC7  109.22,73.66 0 top
IC8  106.68,90.17 0 bottom
JP1  95.25,7.62 0 top
LED1  123.19,86.36 0 bottom
LED2  22.86,7.62 0 bottom
LED3  17.78,7.62 0 bottom
LED4  12.7,7.62 0 bottom
LED5  -243.84,209.55 0 top  (outside the outline)
R1  55.88,93.98 0 bottom
R2  48.26,93.98 0 bottom
R3  40.64,93.98 0 bottom
R4  33.02,93.98 0 bottom
R5  -245.11,203.2 0 top  (outside the outline)
U1  3.81,93.34 0 top
U2  3.81,6.35 0 top
U3  146.69,93.34 0 top
U4  146.69,6.35 0 top

### Tracks (layer width: path | path; a pad name or v marks a point on that pad's centre or on a via)
!BNK0  (2 unrouted)
  Top 0.305: IC7.22 115.57,74.93 114.3,73.66 114.3,53.98 115.57,52.7 IC6.22
!BNK1  (via drill 0.3)  (2 unrouted)
  Top 0.305: IC5.22 v33.02,45.72 33.02,52.7 31.75,53.98 31.75,73.66 33.02,74.93 IC4.22
  Bottom 0.305: 130.18,46.35 33.66,46.35 v33.02,45.72
!BNK2  (via drill 0.3)  (2 unrouted)
  Top 0.305: v77.47,20.32 v77.47,69.85
  Bottom 0.305: IC3.22 73.66,20.32 v77.47,20.32 | IC2.22 73.66,69.85 v77.47,69.85
!FRPE  (2 unrouted)
!MEM  (1 unrouted)
!R  (via drill 0.3)  (3 unrouted)
  Top 0.305: IC5.24 v27.94,48.26 27.94,50.16 26.67,51.44 26.67,73.66 27.94,74.93 IC4.24 | IC7.24 v110.49,77.47 110.49,74.93 109.22,73.66 109.22,51.44 v110.17,50.48 110.49,50.16 IC6.24 110.49,28.57 109.22,27.3 v109.22,26.67
  Bottom 0.305: 73.66,71.12 77.47,71.12 80.64,74.3 92.71,74.3 93.34,73.66 107.31,73.66 110.49,76.83 v110.49,77.47 | v110.17,50.48 108.58,48.9 28.57,48.9 v27.94,48.26 | IC3.24 73.66,22.86 76.2,22.86 79.38,26.04 108.58,26.04 v109.22,26.67
!W  (via drill 0.3)  (3 unrouted)
  Top 0.305: IC4.29 15.24,77.47 13.97,76.2 v13.97,54.61 13.97,45.09 15.24,43.81 IC5.29 | IC7.29 97.79,73.66 96.52,72.39 v96.52,59.05 96.52,45.09 97.79,43.81 IC6.29
  Bottom 0.305: v13.97,54.61 14.61,55.24 92.71,55.24 v96.52,59.05
+3.3V  (2 unrouted)
+12V  (2 unrouted)
AB0  (via drill 0.3)  (2 unrouted)
  Top 0.305: IC5.12 35.56,27.94 36.83,29.21 36.83,54.61 35.56,55.88 IC4.12 v35.56,72.39 | IC6.12 118.11,24.13 119.38,25.4 119.38,54.61 118.11,55.88 IC7.12 118.11,73.66 119.38,74.93 v119.38,78.74
  Bottom 0.305: v35.56,72.39 36.2,73.03 48.9,73.03 49.53,72.39 63.5,72.39 IC2.12 | EXP1.A5 153.67,77.47 146.69,77.47 145.41,78.74 123.19,78.74 122.56,78.11 121.28,78.11 120.65,78.74 v119.38,78.74
AB1  (via drill 0.3)  (1 unrouted)
  Top 0.305: IC5.11 33.02,27.94 34.29,29.21 v34.29,45.09 34.29,53.34 33.02,54.61 IC4.11 v33.02,73.03 | IC6.11 115.57,25.4 116.84,26.67 v116.84,45.09 116.84,53.34 115.57,54.61 IC7.11 115.57,73.66 116.84,74.93 v116.84,76.2
  Bottom 0.305: v116.84,45.09 116.2,45.72 34.92,45.72 v34.29,45.09 | v33.02,73.03 33.66,73.66 IC2.11 | EXP1.A6 153.67,74.93 146.69,74.93 144.15,77.47 126.36,77.47 125.09,76.2 v116.84,76.2
AB2  (via drill 0.3)  (1 unrouted)
  Top 0.305: IC5.10 30.48,27.94 31.75,29.21 v31.75,46.35 31.75,52.07 30.48,53.34 IC4.10 v30.48,73.66 | IC6.10 113.03,25.4 114.3,26.67 v114.3,47.62 114.3,52.07 113.03,53.34 IC7.10 113.03,73.66 114.3,74.93 v114.3,76.2
  Bottom 0.305: v114.3,47.62 113.67,46.99 32.38,46.99 v31.75,46.35 | v30.48,73.66 31.11,74.3 48.9,74.3 49.53,74.93 63.5,74.93 IC2.10 | EXP1.A7 153.67,72.39 146.69,72.39 142.88,76.2 128.91,76.2 127.64,74.93 125.73,74.93 125.09,75.56 118.11,75.56 117.47,74.93 115.57,74.93 v114.3,76.2
AB3  (via drill 0.3)  (1 unrouted)
  Top 0.305: IC5.9 27.94,27.94 29.21,29.21 v29.21,47.62 29.21,50.8 27.94,52.07 IC4.9 27.94,73.66 v28.57,74.3 | IC6.9 110.49,26.67 111.76,27.94 v111.76,50.16 111.76,50.8 110.49,52.07 IC7.9 110.49,73.66 111.76,74.93 v111.76,75.56
  Bottom 0.305: v28.57,74.3 29.21,74.93 48.26,74.93 49.53,76.2 IC2.9 | v111.76,50.16 109.86,48.26 29.84,48.26 v29.21,47.62 | EXP1.A8 153.67,69.85 146.69,69.85 142.24,74.3 130.81,74.3 130.18,73.66 125.09,73.66 123.83,74.93 118.75,74.93 118.11,74.3 113.67,74.3 112.39,75.56 v111.76,75.56
AB4  (via drill 0.3)  (1 unrouted)
  Top 0.305: IC6.8 107.95,27.94 109.22,29.21 109.22,49.53 v108.27,50.48 107.95,50.8 IC7.8 v107.95,72.39 | IC5.8 25.4,27.94 26.67,29.21 v26.67,48.9 26.67,49.53 25.4,50.8 IC4.8 25.4,73.66 v26.67,74.93
  Bottom 0.305: v26.67,74.93 27.3,75.56 47.62,75.56 49.53,77.47 63.5,77.47 IC2.8 | v108.27,50.48 107.31,49.53 27.3,49.53 v26.67,48.9 | EXP1.A9 153.67,67.31 146.69,67.31 142.24,71.75 124.46,71.75 123.83,72.39 114.3,72.39 113.03,73.66 109.22,73.66 v107.95,72.39
AB5  (via drill 0.3)  (1 unrouted)
  Top 0.305: IC7.7 v105.41,62.23 v105.41,51.44 105.41,49.53 106.68,48.26 106.68,29.84 105.41,28.57 IC6.7 | IC5.7 22.86,27.94 24.13,29.21 24.13,48.26 22.86,49.53 v22.86,50.16 IC4.7 22.86,73.66 24.13,74.93 v24.13,76.2
  Bottom 0.305: v22.86,50.16 23.5,50.8 104.78,50.8 v105.41,51.44 | v24.13,76.2 46.99,76.2 49.53,78.74 IC2.7 | EXP1.A10 153.67,64.77 137.16,64.77 134.62,62.23 v105.41,62.23
AB6  (via drill 0.3)  (1 unrouted)
  Top 0.305: IC5.6 20.32,27.94 21.59,29.21 21.59,46.99 20.32,48.26 v20.32,51.44 IC4.6 20.32,75.56 v21.59,76.83 | IC7.6 v102.87,56.52 v102.87,52.7 102.87,48.26 104.14,46.99 104.14,29.84 102.87,28.57 IC6.6 | v136.53,59.69 136.53,60.33 137.16,60.96 v137.16,62.23
  Bottom 0.305: v20.32,51.44 20.95,52.07 102.23,52.07 v102.87,52.7 | v21.59,76.83 46.35,76.83 49.53,80.01 63.5,80.01 IC2.6 | EXP1.A11 153.67,62.23 v137.16,62.23 | v102.87,56.52 103.5,57.15 115.57,57.15 116.2,56.52 118.11,56.52 118.75,55.88 127,55.88 130.81,59.69 v136.53,59.69
AB7  (via drill 0.3)  (2 unrouted)
  Top 0.305: IC5.5 17.78,27.94 19.05,29.21 19.05,45.72 17.78,46.99 v17.78,52.7 IC4.5 | IC7.5 v100.33,58.42 v100.33,53.98 100.33,46.99 101.6,45.72 101.6,30.48 100.33,29.21 IC6.5
  Bottom 0.305: v17.78,52.7 18.41,53.34 99.69,53.34 v100.33,53.98 | EXP1.A12 153.67,59.69 138.43,59.69 137.16,58.42 130.81,58.42 127.64,55.24 118.11,55.24 117.47,55.88 115.57,55.88 114.94,56.52 104.14,56.52 102.87,55.24 102.23,55.24 101.6,55.88 101.6,57.15 v100.33,58.42
AB8  (via drill 0.3)  (1 unrouted)
  Top 0.305: IC4.27 20.32,77.47 19.05,76.2 v19.05,52.07 19.05,47.62 20.32,46.35 IC5.27 | IC7.27 v102.87,76.2 102.87,71.12 101.6,69.85 v101.6,53.34 101.6,47.62 102.87,46.35 v102.87,40.64 IC6.27 102.87,29.84 v101.6,28.57
  Bottom 0.305: 78.11,76.2 94.61,76.2 95.25,75.56 102.23,75.56 v102.87,76.2 | v19.05,52.07 19.68,52.7 100.97,52.7 v101.6,53.34 | IC3.27 76.2,26.67 77.47,27.94 100.97,27.94 v101.6,28.57 | EXP1.A20 153.67,39.37 148.59,39.37 147.32,40.64 v102.87,40.64
AB9  (via drill 0.3)  (1 unrouted)
  Top 0.305: IC4.26 22.86,74.93 21.59,73.66 v21.59,50.8 21.59,48.9 22.86,47.62 IC5.26 | IC7.26 v105.41,76.2 105.41,71.12 104.14,69.85 v104.14,52.07 104.14,48.9 105.41,47.62 v105.41,39.37 IC6.26 105.41,29.84 104.14,28.57 v104.14,27.94
  Bottom 0.305: 79.38,75.56 93.98,75.56 94.61,74.93 104.14,74.93 v105.41,76.2 | v21.59,50.8 22.23,51.44 103.5,51.44 v104.14,52.07 | IC3.26 73.66,25.4 76.2,25.4 78.11,27.3 103.5,27.3 v104.14,27.94 | EXP1.A21 153.67,36.83 148.59,36.83 146.05,39.37 v105.41,39.37
AB10  (via drill 0.3)  (1 unrouted)
  Top 0.305: IC5.23 v30.48,46.99 30.48,51.44 29.21,52.7 29.21,73.66 30.48,74.93 IC4.23 | IC7.23 113.03,74.93 111.76,73.66 v111.76,68.58 111.76,52.7 113.03,51.44 v113.03,48.9 IC6.23 v113.03,34.29 113.03,27.3 v111.76,26.04
  Bottom 0.305: v111.76,68.58 100.33,68.58 | v30.48,46.99 31.11,47.62 111.76,47.62 v113.03,48.9 | IC3.23 76.2,21.59 80.01,25.4 111.12,25.4 v111.76,26.04 | EXP1.A22 153.67,34.29 v113.03,34.29
AB11  (via drill 0.3)  (1 unrouted)
  Top 0.305: IC4.25 25.4,74.93 24.13,73.66 24.13,50.16 v24.45,49.85 25.4,48.9 IC5.25 | IC7.25 v107.95,76.83 107.95,74.93 106.68,73.66 v106.68,50.8 106.68,50.16 107.95,48.9 IC6.25 v107.95,31.75 107.95,29.84 106.68,28.57 v106.68,27.3
  Bottom 0.305: 80.01,74.93 93.34,74.93 93.98,74.3 105.41,74.3 v107.95,76.83 | v106.68,50.8 106.05,50.16 24.77,50.16 v24.45,49.85 | IC3.25 76.2,24.13 78.74,26.67 106.05,26.67 v106.68,27.3 | EXP1.A23 153.67,31.75 v107.95,31.75
AB12  (via drill 0.3)  (2 unrouted)
  Top 0.305: IC5.4 15.24,27.94 16.51,29.21 16.51,44.45 15.24,45.72 v15.24,53.98 IC4.4 | IC6.4 97.79,30.48 99.06,31.75 v99.06,33.02 99.06,44.45 97.79,45.72 v97.79,59.05 IC7.4 | IC2.4 64.77,87.63
  Bottom 0.305: v15.24,53.98 15.88,54.61 93.34,54.61 v97.79,59.05 | EXP1.A24 153.67,29.21 102.87,29.21 v99.06,33.02
AEXT0  (via drill 0.3)  (2 unrouted)
  Top 0.305: IC4.28 17.78,77.47 16.51,76.2 v16.51,53.34 16.51,46.35 17.78,45.09 IC5.28 | IC7.28 v100.33,77.47 100.33,72.39 99.06,71.12 v99.06,59.05 v99.06,54.61 99.06,46.35 100.33,45.09 IC6.28 100.33,31.11 99.06,29.84 v99.06,29.21
  Bottom 0.305: v100.33,77.47 99.06,76.2 95.89,76.2 95.25,76.83 77.47,76.83 76.83,76.2 | v16.51,53.34 17.14,53.98 98.42,53.98 v99.06,54.61 | IC3.28 73.66,27.94 76.2,27.94 76.83,28.57 98.42,28.57 v99.06,29.21 | EXP1.B13 151.13,57.15 130.81,57.15 128.27,54.61 117.47,54.61 116.84,55.24 114.94,55.24 114.3,55.88 104.78,55.88 103.5,54.61 101.6,54.61 | v99.06,59.05 99.06,57.15
AEXT1  (via drill 0.3)  (1 unrouted)
  Top 0.305: IC5.3 12.7,27.94 13.97,29.21 13.97,43.18 12.7,44.45 v12.7,55.24 IC4.3 | IC6.3 95.25,29.21 v95.89,29.84 96.52,30.48 96.52,43.18 95.25,44.45 v95.25,55.24 v95.25,59.05 IC7.3 95.25,73.03 96.52,74.3 v96.52,77.47
  Bottom 0.305: v96.52,77.47 88.9,77.47 85.09,81.28 IC2.29 | v12.7,55.24 13.34,55.88 92.08,55.88 v95.25,59.05 | v95.89,29.84 95.25,29.21 IC3.29 | EXP1.B14 151.13,54.61 130.81,54.61 129.54,53.34 101.6,53.98 | 98.42,56.52 96.52,56.52 v95.25,55.24
AEXT2  (via drill 0.3)  (3 unrouted)
  Top 0.305: IC5.31 10.16,41.27 8.89,42.55 v8.89,57.15 8.89,73.66 10.16,74.93 IC4.31 | IC7.31 92.71,74.93 91.44,73.66 v91.44,59.05 91.44,42.55 92.71,41.27 IC6.31
  Bottom 0.305: v8.89,57.15 9.53,57.78 90.17,57.78 v91.44,59.05
AEXT3  (via drill 0.3)  (3 unrouted)
  Top 0.305: IC5.2 10.16,27.94 11.43,29.21 11.43,41.91 10.16,43.18 v10.16,56.52 IC4.2 | IC6.2 92.71,29.21 93.98,30.48 93.98,41.91 92.71,43.18 v92.71,59.05 IC7.2 | IC2.2 67.31,87.63
  Bottom 0.305: v10.16,56.52 10.79,57.15 90.81,57.15 v92.71,59.05
AEXT4  (via drill 0.3)  (3 unrouted)
  Top 0.305: IC5.30 12.7,42.55 11.43,43.81 v11.43,55.88 11.43,73.66 12.7,74.93 IC4.30 | IC7.30 95.25,74.93 93.98,73.66 v93.98,59.05 93.98,43.81 95.25,42.55 IC6.30
  Bottom 0.305: v11.43,55.88 12.06,56.52 91.44,56.52 v93.98,59.05
AEXT5  (via drill 0.3)  (3 unrouted)
  Top 0.305: IC4.1 v7.62,57.78 7.62,41.91 8.89,40.64 8.89,29.21 7.62,27.94 IC5.1 | IC7.1 v90.17,59.05 90.17,41.91 91.44,40.64 91.44,30.48 90.17,29.21 IC6.1
  Bottom 0.305: v7.62,57.78 8.26,58.42 89.53,58.42 v90.17,59.05
AEXT6  (1 unrouted)
AEXT7  (1 unrouted)
DB0  (via drill 0.3)  (1 unrouted)
  Top 0.305: IC4.13 v38.1,71.12 | v121.92,79.38 121.92,74.93 120.65,73.66 IC7.13
  Bottom 0.305: v38.1,71.12 39.37,72.39 48.26,72.39 49.53,71.12 IC2.13 | v121.92,79.38 144.78,79.38 146.05,79.38 146.69,78.74 EXP1.C5
DB1  (via drill 0.3)  (1 unrouted)
  Top 0.305: v40.64,61.59 IC4.14 | v123.19,59.05 IC7.14 123.19,73.66 124.46,74.93 v124.46,77.47
  Bottom 0.305: v40.64,61.59 41.27,60.96 87,60.96 88.27,62.23 101.6,62.23 104.14,59.69 122.56,59.69 v123.19,59.05 | v124.46,77.47 125.09,78.11 144.78,78.11 146.69,76.2 EXP1.C6
DB2  (via drill 0.3)
  Top 0.305: v125.73,60.33 IC7.15 125.73,73.66 127,74.93 v127,76.2 | v43.18,62.87 IC4.15 v43.18,71.12
  Bottom 0.305: v43.18,62.87 43.81,62.23 85.72,62.23 87,63.5 102.87,63.5 105.41,60.96 125.09,60.96 v125.73,60.33 | v43.18,71.12 43.81,71.75 47.62,71.75 48.9,70.48 60.33,70.48 60.96,69.85 63.5,69.85 IC2.15 | v127,76.2 127.64,76.83 143.51,76.83 146.69,73.66 EXP1.C7
DB3  (via drill 0.3)  (2 unrouted)
  Top 0.305: IC4.17 45.72,74.93 44.45,73.66 v44.45,63.5 | v129.54,74.93 128.27,76.2 IC7.17
  Bottom 0.305: EXP1.C8 146.69,71.12 142.24,75.56 130.18,75.56 v129.54,74.93
DB4  (via drill 0.3)  (1 unrouted)
  Top 0.305: IC4.18 43.18,74.93 41.91,73.66 v41.91,62.23 | v124.46,59.69 v124.46,73.03 124.46,73.66 125.73,74.93 IC7.18
  Bottom 0.305: v41.91,62.23 42.55,61.59 86.36,61.59 87.63,62.87 102.23,62.87 104.78,60.33 123.83,60.33 v124.46,59.69 | EXP1.C9 146.69,68.58 142.24,73.03 v124.46,73.03
DB5  (via drill 0.3)  (1 unrouted)
  Top 0.305: IC4.19 40.64,74.93 39.37,73.66 v39.37,60.96 | v121.92,58.42 v121.92,63.5 121.92,73.66 123.19,74.93 IC7.19
  Bottom 0.305: v39.37,60.96 40.01,60.33 87.63,60.33 88.9,61.59 100.97,61.59 103.5,59.05 121.28,59.05 v121.92,58.42 | EXP1.C10 137.16,66.04 134.62,63.5 v121.92,63.5
DB6  (via drill 0.3)  (1 unrouted)
  Top 0.305: IC4.20 38.1,74.93 36.83,73.66 v36.83,60.33 | v119.38,57.78 119.38,73.66 120.65,74.93 IC7.20
  Bottom 0.305: v36.83,60.33 37.47,59.69 88.27,59.69 89.53,60.96 100.33,60.96 102.87,58.42 118.75,58.42 v119.38,57.78 120.02,57.15 125.73,57.15 129.54,60.96 134.62,60.96 137.16,63.5 EXP1.C11
DB7  (via drill 0.3)  (1 unrouted)
  Top 0.305: IC4.21 35.56,74.93 34.29,73.66 v34.29,59.69 | v116.84,57.78 116.84,73.66 118.11,74.93 IC7.21
  Bottom 0.305: v34.29,59.69 34.92,59.05 88.9,59.05 90.17,60.33 99.69,60.33 102.23,57.78 v116.84,57.78 118.11,57.78 119.38,56.52 126.36,56.52 130.18,60.33 135.25,60.33 135.89,60.96 EXP1.C12
DB8  (3 unrouted)
DB9  (3 unrouted)
DB10  (3 unrouted)
DB11  (3 unrouted)
DB12  (3 unrouted)
DB13  (3 unrouted)
DB14  (3 unrouted)
DB15  (3 unrouted)
  Top 0.305: 116.84,15.24 116.84,24.77 118.11,26.04 IC6.21
GND  (19 unrouted)
  pour Bottom (isolate 0.406, rank 6, no thermals): 0,100.33 160.02,100.33 160.02,0 0,0
  pour Bottom (isolate 0.406, rank 6, no thermals): 0,100.33 160.02,100.33 160.02,0 0,0
N$1  (1 unrouted)
N$2  (1 unrouted)
N$3  (1 unrouted)
N$4  (1 unrouted)
N$5  (1 unrouted)
N$6  (1 unrouted)
N$7  (1 unrouted)
N$8  (1 unrouted)
N$9  (1 unrouted)
N$10  (1 unrouted)
VCC  (4 unrouted)
  pour Top (isolate 0.406, rank 6, no thermals): 0,100.33 160.02,100.33 160.02,0 0,0